# EAGLE design vv_mod_v1 (EAGLE 6.4)
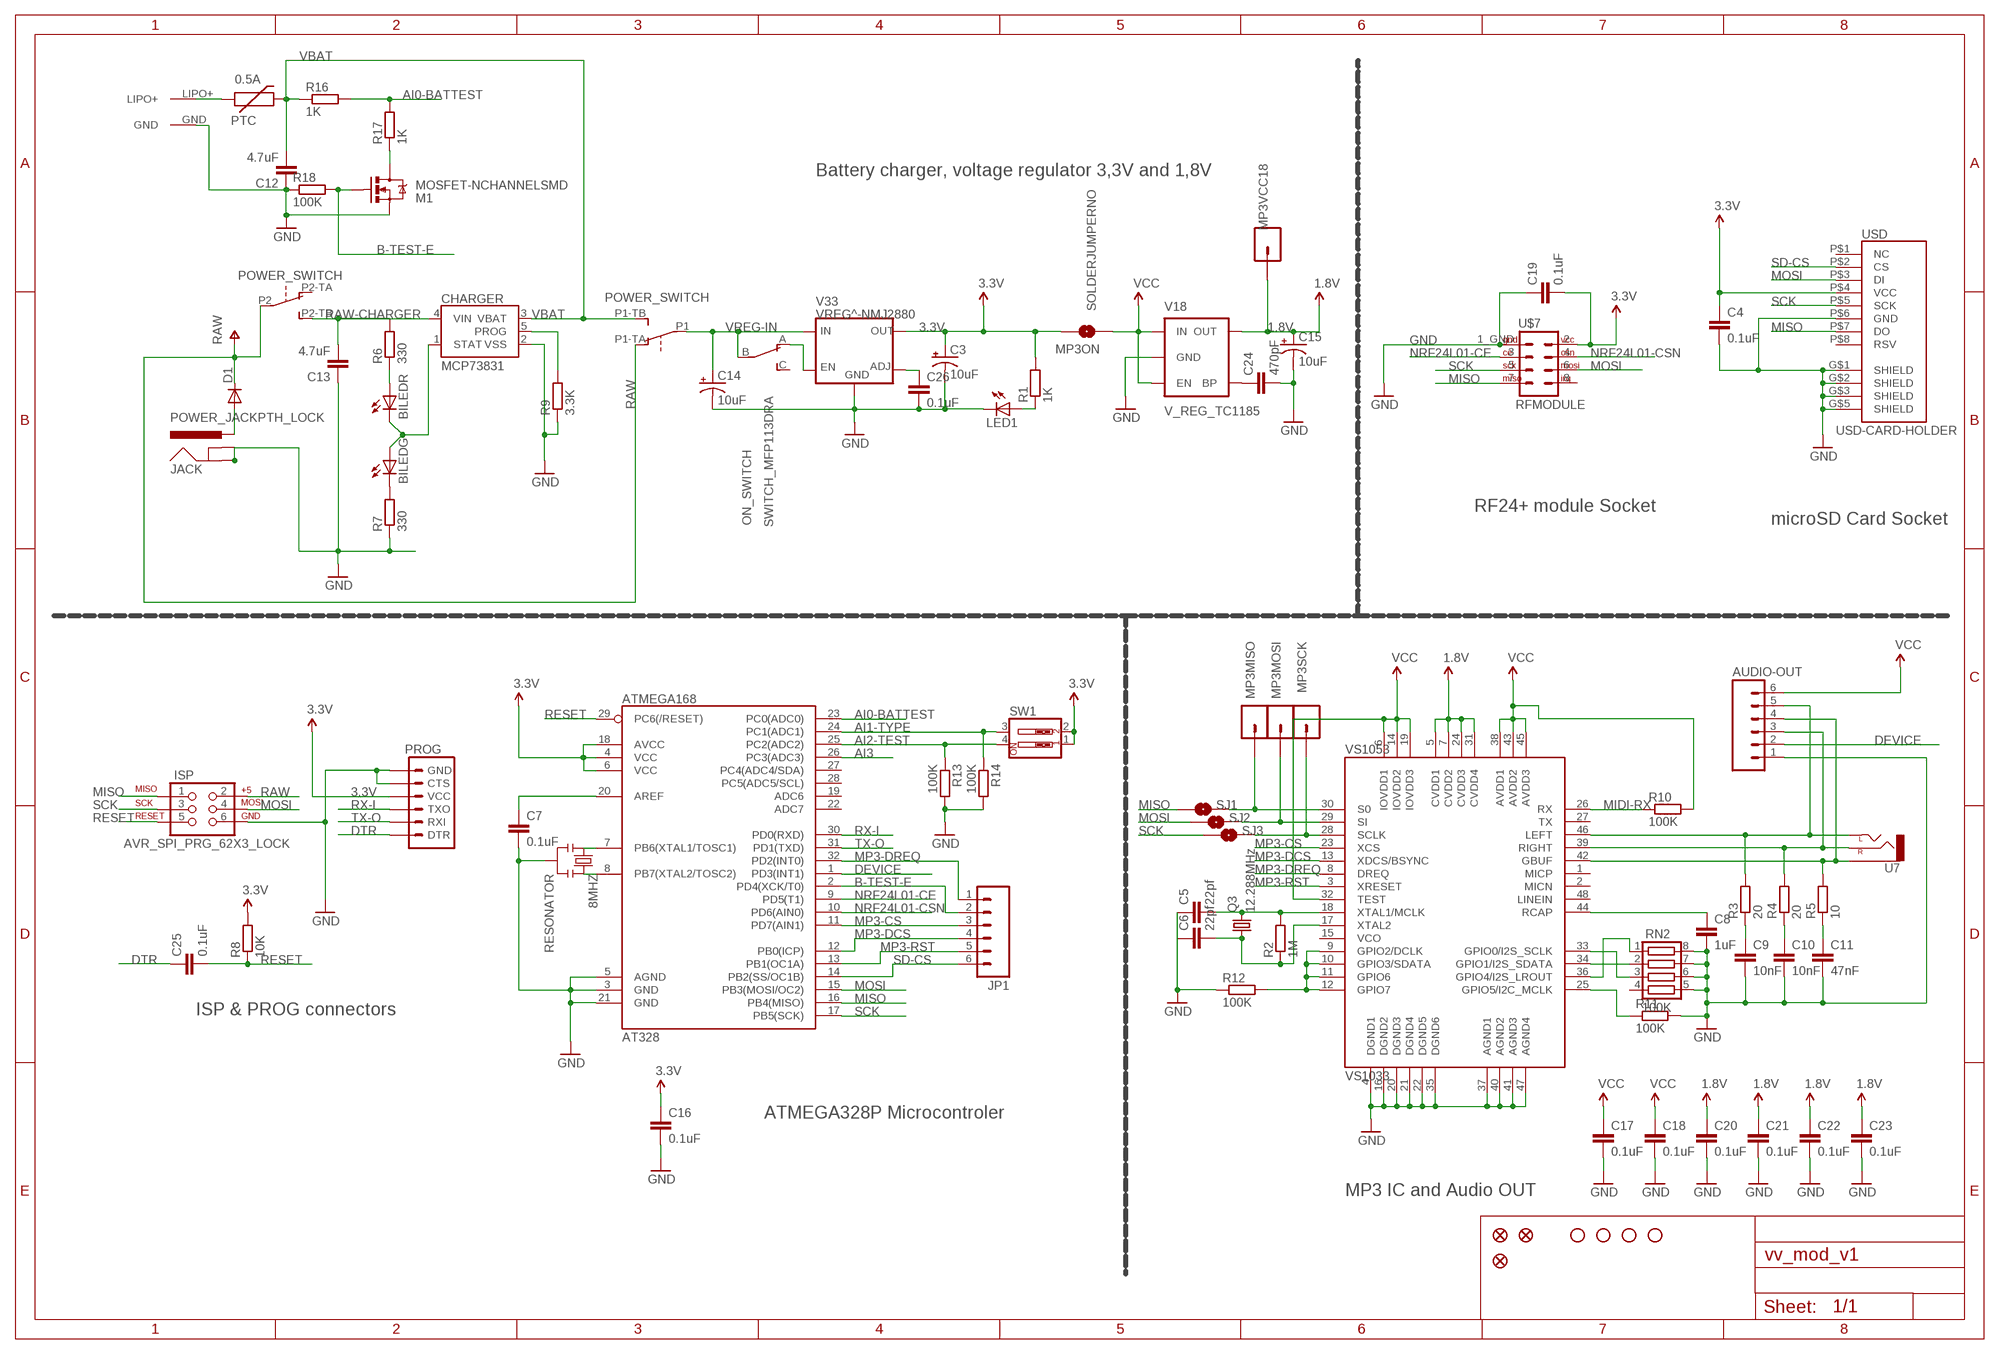
[diagram p0: schematic, sheet 1]

## Parts
0.5A  PTC  [PTC-1210]
8MHZ  RESONATOR  [RESONATOR_7MM]
AT328  ATMEGA168  [TQFP32-08]
AUDIO-OUT  M06LOCK  [1X06_LOCK]
BILED  BILED  [2XLED]
C3  10uF  CAP_POL1206  [EIA3216]
C4  0.1uF  C-EUC0805  [C0805]
C5  22pf  C-EUC0603  [C0603]
C6  22pf  C-EUC0603  [C0603]
C7  0.1uF  C-EUC0805  [C0805]
C8  1uF  C-EUC0603  [C0603]
C9  10nF  C-EUC0603  [C0603]
C10  10nF  C-EUC0603  [C0603]
C11  47nF  C-EUC0603  [C0603]
C12  4.7uF  C-EUC0603  [C0603]
C13  4.7uF  C-EUC0603  [C0603]
C14  10uF  CAP_POL1206  [EIA3216]
C15  10uF  CAP_POL1206  [EIA3216]
C16  0.1uF  C-EUC0805  [C0805]
C17  0.1uF  C-EUC0805  [C0805]
C18  0.1uF  C-EUC0805  [C0805]
C19  0.1uF  C-EUC0805  [C0805]
C20  0.1uF  C-EUC0805  [C0805]
C21  0.1uF  C-EUC0805  [C0805]
C22  0.1uF  C-EUC0805  [C0805]
C23  0.1uF  C-EUC0805  [C0805]
C24  470pF  C-EUC0603  [C0603]
C25  0.1uF  C-EUC0805  [C0805]
C26  0.1uF  C-EUC0805  [C0805]
CHARGER  MCP73831  [SOT23-5]
D1  DIODESMA-KIT  [SMA-DIODE-KIT]
ISP  AVR_SPI_PRG_62X3_LOCK  [2X3_LOCK]
JACK  POWER_JACKPTH_LOCK  [POWER_JACK_PTH_LOCK]
JP1  M06SIP  [1X06]
JP2  FIDUCIAL1X2.5  [FIDUCIAL-1X2.5]
JP3  FIDUCIAL1X2.5  [FIDUCIAL-1X2.5]
JP4  STAND-OFF  [STAND-OFF]
JP5  STAND-OFF  [STAND-OFF]
JP6  STAND-OFF  [STAND-OFF]
JP7  STAND-OFF  [STAND-OFF]
JP8  FIDUCIAL1X2.5  [FIDUCIAL-1X2.5]
LED1  LED1206  [LED-1206]
M1  MOSFET-NCHANNELSMD  [SOT23-3]
MP3MISO  M01SMD-4.5X1.5  [PAD-1.5X4.5]
MP3MOSI  M01SMD-4.5X1.5  [PAD-1.5X4.5]
MP3ON  SOLDERJUMPERNO  [SJ_2S-NO]
MP3SCK  M01SMD-4.5X1.5  [PAD-1.5X4.5]
MP3VCC18  M01SMD-4.5X1.5  [PAD-1.5X4.5]
ON_SWITCH  SWITCH_MFP113DRA  [SWITCH]
POWER_SWITCH  JS202011SCQNPIN  [SWITCHPOWER]
PROG  ARDUINO_SERIAL_PROGRAMLOCK  [1X06_LOCK]
Q3  12.288MHz  CRYSTALHC49UP  [HC49UP]
R1  1K  R-EU_R0603  [R0603]
R2  1M  R-EU_R0603  [R0603]
R3  20  R-EU_R0603  [R0603]
R4  20  R-EU_R0603  [R0603]
R5  10  R-EU_R0603  [R0603]
R6  330  R-EU_R0805  [R0805]
R7  330  R-EU_R0805  [R0805]
R8  10K  R-EU_R0603  [R0603]
R9  3.3K  R-EU_R0603  [R0603]
R10  100K  R-EU_R0805  [R0805]
R11  100K  R-EU_R0805  [R0805]
R12  100K  R-EU_R0805  [R0805]
R13  100K  R-EU_R0805  [R0805]
R14  100K  R-EU_R0805  [R0805]
R16  1K  R-EU_R0603  [R0603]
R17  1K  R-EU_R0603  [R0603]
R18  100K  R-EU_R0805  [R0805]
RN2  100K  CTS742C083  [CTS742C083]
SJ1  SOLDERJUMPERNO  [SJ_2S-NO]
SJ2  SOLDERJUMPERNO  [SJ_2S-NO]
SJ3  SOLDERJUMPERNO  [SJ_2S-NO]
SW1  SW_DIP-2  [DIPSWITCH-02]
U7  AUDIO-JACKPTH  [AUDIO-JACK]
U$7  RFMODULE  [2X5_RFMODULE]
U$8  LIPO_PAD  [2X1_LIPO_PAD]
USD  USD-CARD-HOLDER  [MICRO-SD-MOLEX-47579-001]
V18  V_REG_TC1185  V_REG_LDOSMD  [SOT23-5]
V33  VREG^-NMJ2880  [SOT-89]
VS1053  VS1033  [LQFP-48]

## Nets
1.8V: C15.A(+) C20.1 C21.1 C22.1 C23.1 MP3VCC18.P$1 V18.5(OUT) VS1053.5(CVDD1) VS1053.7(CVDD2) VS1053.24(CVDD3) VS1053.31(CVDD4)
3.3V [3.3V]: AT328.4(VCC) AT328.6(VCC) AT328.18(AVCC) C3.A(+) C4.1 C16.1 C19.2 MP3ON.2 PROG.4(VCC) R1.2 R8.2 SW1.1 SW1.2 U$7.2(VCC) USD.P$4(VCC) V33.4(OUT)
100K-1: R12.2 VS1053.9(GPIO2/DCLK) VS1053.10(GPIO3/SDATA) VS1053.11(GPIO6) VS1053.12(GPIO7)
AI0-BATTEST: AT328.23(PC0(ADC0)) R16.2 R17.2
AI1-TYPE: AT328.24(PC1(ADC1)) R14.1 SW1.3
AI2-TEST: AT328.25(PC2(ADC2)) R13.1 SW1.4
AI3: AT328.26(PC3(ADC3))
AREF: AT328.20(AREF) C7.1
B-TEST-E: AT328.2(PD4(XCK/T0)) JP1.2 M1.1(G) R18.2
DEVICE: AT328.1(PD3(INT1)) AUDIO-OUT.2
DTR: C25.1 PROG.1(DTR)
GBUF: AUDIO-OUT.4 R5.2 U7.SLEEVE VS1053.42(GBUF)
GND [GND]: 8MHZ.2 AT328.3(GND) AT328.5(AGND) AT328.21(GND) AUDIO-OUT.1 C3.C(-) C4.2 C5.1 C6.1 C7.2 C8.2 C9.2 C10.2 C11.2 C12.1 C13.1 C14.C(-) C15.C(-) C16.2 C17.2 C18.2 C19.1 C20.2 C21.2 C22.2 C23.2 C24.2 C26.2 CHARGER.2(VSS) ISP.6 JACK.GND JACK.GNDBREAK LED1.C M1.2(S) PROG.5(CTS) PROG.6(GND) R7.1 R9.1 R11.2 R12.1 R13.2 R14.2 R18.1 RN2.5 RN2.6 RN2.7 RN2.8 U$7.1_GND(GND) U$8.GND USD.G$1(SHIELD) USD.G$2(SHIELD) USD.G$3(SHIELD) USD.G$5(SHIELD) USD.P$6(GND) V18.2(GND) V33.2(GND) VS1053.4(DGND1) VS1053.16(DGND2) VS1053.20(DGND3) VS1053.21(DGND4) VS1053.22(DGND5) VS1053.35(DGND6) VS1053.37(AGND1) VS1053.40(AGND2) VS1053.41(AGND3) VS1053.47(AGND4)
LEFT: AUDIO-OUT.5 R3.2 U7.TIP(LEFT) VS1053.46(LEFT)
MIDI-RX: R10.1 VS1053.26(RX)
MISO: AT328.16(PB4(MISO)) ISP.1 SJ1.1 U$7.7(MISO) USD.P$7(DO)
MISOMP3: MP3MISO.P$1 SJ1.2 VS1053.30(S0)
MOSI: AT328.15(PB3(MOSI/OC2)) ISP.4 SJ2.1 U$7.6(MOSI) USD.P$3(DI)
MOSIMP3: MP3MOSI.P$1 SJ2.2 VS1053.29(SI)
MP3-CS: AT328.11(PD7(AIN1)) JP1.3 VS1053.23(XCS)
MP3-DCS: AT328.12(PB0(ICP)) JP1.4 VS1053.13(XDCS/BSYNC)
MP3-DREQ: AT328.32(PD2(INT0)) JP1.1 VS1053.8(DREQ)
MP3-RST: AT328.13(PB1(OC1A)) JP1.5 VS1053.3(XRESET)
N$1: ON_SWITCH.A(O) V33.1(EN)
N$2: C26.1 V33.3(ADJ)
N$3: RN2.1 VS1053.36(GPIO4/I2S_LROUT)
N$4: LED1.A R1.1
N$5: RN2.3 VS1053.33(GPIO0/I2S_SCLK)
N$6: R11.1 VS1053.25(GPIO5/I2C_MCLK)
N$7: 8MHZ.1 AT328.7(PB6(XTAL1/TOSC1))
N$8: 8MHZ.3 AT328.8(PB7(XTAL2/TOSC2))
N$9: RN2.2 VS1053.34(GPIO1/I2S_SDATA)
N$10: D1.A JACK.PWR
N$16: C9.1 R3.1
N$17: C10.1 R4.1
N$18: C11.1 R5.1
N$20: BILED.A2(R:A) R6.1
N$22: BILED.C3(G:C) R7.2
N$24: CHARGER.5(PROG) R9.2
N$25: M1.3(D) R17.1
N$28: C24.1 V18.4(BP)
NRF24L01-CE: AT328.9(PD5(T1)) U$7.3(CE)
NRF24L01-CSN: AT328.10(PD6(AIN0)) U$7.4(CSN)
RAW: D1.C ISP.2 POWER_SWITCH.P1-TA(O) POWER_SWITCH.P2(P)
RAW-CHARGER: C13.2 CHARGER.4(VIN) POWER_SWITCH.P2-TB(S) R6.2
RCAP: C8.1 VS1053.44(RCAP)
RESET: AT328.29(PC6(/RESET)) C25.2 ISP.5 R8.1
RIGHT: AUDIO-OUT.3 R4.2 U7.RING(RIGHT) VS1053.39(RIGHT)
RX-I: AT328.30(PD0(RXD)) PROG.3(TXO)
SCK: AT328.17(PB5(SCK)) ISP.3 SJ3.1 U$7.5(SCK) USD.P$5(SCK)
SCKMP3: MP3SCK.P$1 SJ3.2 VS1053.28(SCLK)
SD-CS: AT328.14(PB2(SS/OC1B)) JP1.6 USD.P$2(CS)
STAT: BILED.A1(G:A) BILED.C4(R:C) CHARGER.1(STAT)
TX-O: AT328.31(PD1(TXD)) PROG.2(RXI)
VBAT: 0.5A.2 C12.2 CHARGER.3(VBAT) POWER_SWITCH.P1-TB(S) R16.1
VBAT-RAW: 0.5A.1 U$8.LIPO+
VCC [3.3V]: AUDIO-OUT.6 C17.1 C18.1 MP3ON.1 R10.2 V18.1(IN) V18.3(EN) VS1053.6(IOVDD1) VS1053.14(IOVDD2) VS1053.19(IOVDD3) VS1053.32(TEST) VS1053.38(AVDD1) VS1053.43(AVDD2) VS1053.45(AVDD3)
VREG-IN: C14.A(+) ON_SWITCH.B(P) POWER_SWITCH.P1(P) V33.5(IN)
XTAL1_MP3: C5.2 Q3.2 R2.2 VS1053.18(XTAL1/MCLK)
XTAL2_MP3: C6.2 Q3.1 R2.1 VS1053.17(XTAL2)
Unconnected: AT328.19(ADC6) AT328.22(ADC7) AT328.27(PC4(ADC4/SDA)) AT328.28(PC5(ADC5/SCL)) ON_SWITCH.C(S) POWER_SWITCH.P2-TA(O) RN2.4 U$7.8(IRQ) USD.P$1(NC) USD.P$8(RSV) VS1053.1(MICP) VS1053.2(MICN) VS1053.15(VCO) VS1053.27(TX) VS1053.48(LINEIN)

## Notes on the sheet
- Battery charger, voltage regulator 3,3V and 1,8V
- RF24+ module Socket
- microSD Card Socket
- ISP & PROG connectors
- ATMEGA328P Microcontroler
- MP3 IC and Audio OUT

## Library data of the parts
0.5A = pierre_vv:PTC
8MHZ = pierre_vv:RESONATOR
AT328 = SparkFun:ATMEGA168
AUDIO-OUT JP1 = SparkFun:M06: Header 6 Standard 6-pin 0.1" header. Use with straight break away headers (SKU : PRT-00116), right angle break away headers (PRT-00553), swiss pins (PRT-00743), machine pins (PRT-00117), and female headers (PRT-00115). Molex polarized connector foot print use with SKU : PRT-08094 with associated crimp pins and housings. NOTES ON THE VARIANTS LOCK and LOCK_LONGPADS... This footprint was designed to help hold the alignment of a through-hole component (i.e. 6-pin header) while soldering it into place. You may notice that each hole has been shifted either up or down by 0.005 of an inch from it's more standard position (which is a perfectly straight line). This slight alteration caused the pins (the squares in the middle) to touch the edges of the holes. Because they are alternating, it causes a "brace" to hold the component in place. 0.005 has proven to be the perfect amount of "off-center" position when using our standard breakaway headers. Although looks a little odd when you look at the bare footprint, once you have a header in there, the alteration is very hard to notice. Also, if you push a header all the way into place, it is covered up entirely on the bottom side. This idea of altering the position of holes to aid alignment will be further integrated into the Sparkfun Library for other footprints. It can help hold any component with 3 or more connection pins.
BILED = pierre_vv:BILED
C3 C14 C15 = SparkFun:CAP_POL: Capacitor Polarized These are standard SMD and PTH capacitors. Normally 10uF, 47uF, and 100uF in electrolytic and tantalum varieties. Always verify the external diameter of the through hole cap, it varies with capacity, voltage, and manufacturer. The EIA devices should be standard.
C4-C13 C16-C26 = rcl:C-EU: CAPACITOR, European symbol
CHARGER = SparkFun:MCP73831: Microchip's MCP73831 Miniature single cell, fully integrated Li-Ion, Li-polymer charge management controller http://ww1.microchip.com/downloads/en/DeviceDoc/21984a.pdf
D1 = SparkFun:DIODE: Diode These are standard reverse protection diodes and small signal diodes. SMA package can handle up to about 1A. SOD-323 can handle about 200mA. What the SOD-323 package when ordering, there are some mfgs out there that are 5-pin packages.
ISP = SparkFun:AVR_SPI_PRG_6: AVR ISP 6 Pin This is the reduced ISP connector for AVR programming. Common on Arduino. This footprint will take up less PCB space and can be used with a 10-pin to 6-pin adapter such as SKU: BOB-08508
JACK = SparkFun:POWER_JACK: Power Jack This is the standard 5.5mm barrel jack for power. The PTH is the most common, proven, reliable, footprint. All others are experimental. The Slot footprint only works if the mill layer is transmitted to the PCB fab house so be warned. Spark Fun Electronics SKU : PRT-00119. Mating wall wart : TOL-00298 (and others)
JP2 JP3 JP8 = SparkFun:FIDUCIAL: Fiducial Alignment Points Various fiducial points for machine vision alignment.
JP4-JP7 = SparkFun:STAND-OFF: Stand Off This is the mechanical footprint for a #4 phillips button head screw. Use the keepout ring to avoid running the screw head into surrounding components. SKU : PRT-00447
LED1 = SparkFun:LED: LEDs Standard schematic elements and footprints for 5mm, 3mm, 1206, and 0603 sized LEDs. 5mm - Spark Fun Electronics SKU : COM-00529 (and others)
M1 = SparkFun:MOSFET-NCHANNEL
MP3MISO MP3MOSI MP3SCK MP3VCC18 = SparkFun:M01: Header 1 Standard 1-pin 0.1" header. Use with straight break away headers (SKU : PRT-00116), right angle break away headers (PRT-00553), swiss pins (PRT-00743), machine pins (PRT-00117), and female headers (PRT-00115).
MP3ON SJ1-SJ3 = SparkFun:SOLDERJUMPER: Solder Jumper Standard SMD solder jumper. Used to automate production. Two varients : Normally Open and Normally Closed are the same, but have different paste layers. NC will have a large amount of paste and should jumper during reflow.
ON_SWITCH = pierre_vv:SWITCH_MFP113DRA
POWER_SWITCH = pierre_vv:JS202011SCQN
PROG = SparkFun:ARDUINO_SERIAL_PROGRAM
Q3 = crystal:CRYSTAL: CRYSTAL; OC_FARNELL: unknown; OC_NEWARK: unknown
R1-R14 R16-R18 = rcl:R-EU_: RESISTOR, European symbol
RN2 = resistor-net:CTS742C083: Chip Resistor Array 4 Single Resistor Source: http://www.ctscorp.com/components/Datasheets/CTSChipArrayDs.pdf; OC_FARNELL: unknown; OC_NEWARK: unknown
SW1 = SparkFun:SW_DIP-2: DIP SWITCH
U7 = SparkFun:AUDIO-JACK: 3.5mm Audio Jack Simple 3.5mm common PCB mount audio jack. SKU: PRT-08032
U$7 = pierre_vv:RFMODULE
U$8 = pierre_vv:LIPO_PAD
USD = pierre_vv:USD-CARD-HOLDER
V18 = SparkFun:V_REG_LDO: Voltage Regulator LDO Standard 150mA LDO voltage regulator in SOT-23 layout. Micrel part MIC5205. BP (by-pass) pin is used to lower output noise with 470pF cap.
V33 = pierre_vv:VREG^-NMJ2880
VS1053 = SparkFun:VS1033

## Net classes
0 default: width 0.203 mm
1 GND: width 0.254 mm
2 3.3V: width 0.254 mm

## Board
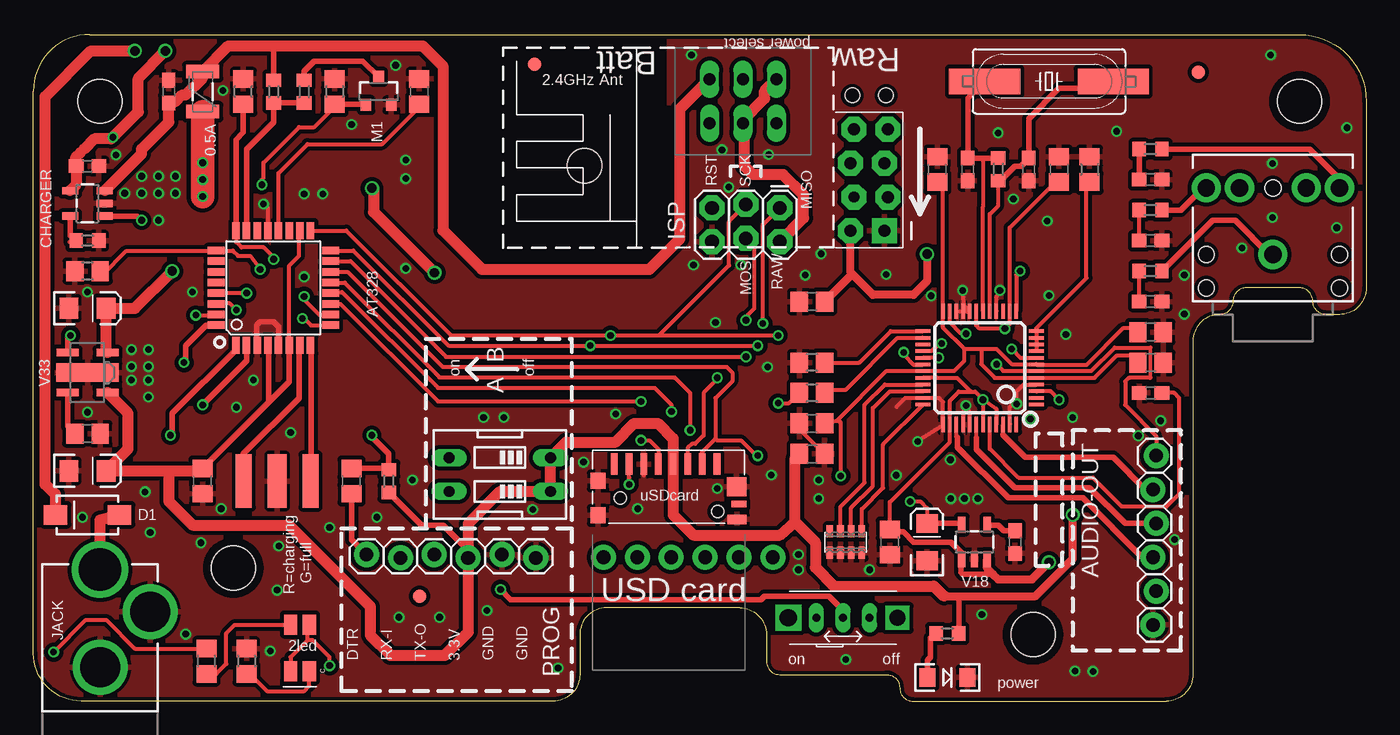
[diagram p1: board, top side]
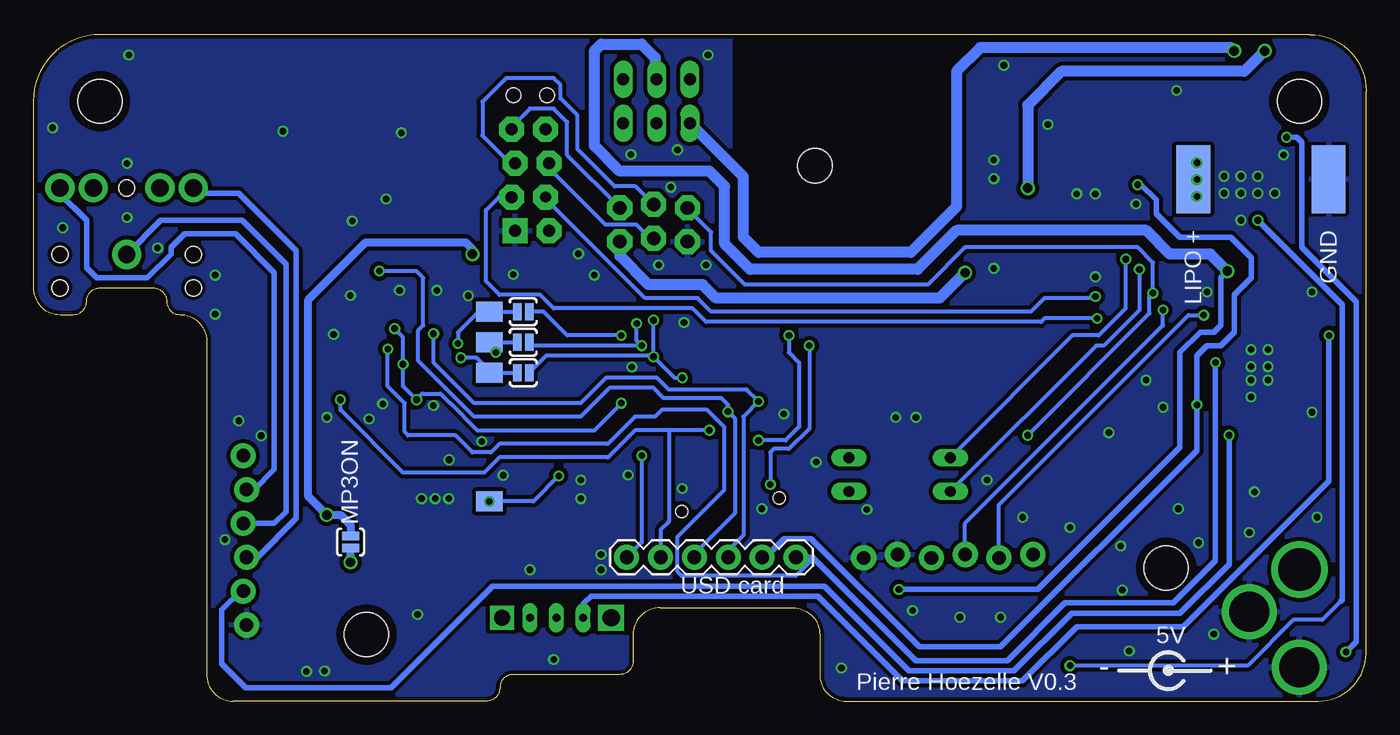
[diagram p2: board, bottom side, seen from below]

Size 100 x 50 mm. Coordinates in mm from the lower left corner, seen from the top.
Outline: 4.24,50 arc90 0,45.76 0,3.61 arc90 3.61,0 39,0 arc90 41,2 41,5 arc-90 43,7 53,7 arc-90 55,5 55,3 arc90 56,2 64,2 arc-90 65,1 arc90 66,0 85,0 arc90 87,2 87,27 arc-90 89,29 arc90 90,30 arc-90 91,31 95,31 arc-90 96,30 arc90 97,29 98,29 arc90 100,31 100,45 arc90 95,50 4.24,50
Copper layers (1*16): Top 0.035mm / dielectric 1.5mm / Bottom 0.035mm
Design rules "Fusion_eagle_rule_v1.1": minimum track width 6mil, minimum drill 12mil, track to track 6mil, track to pad 6mil, pad to pad 6mil, via to via 6mil, smd to smd 0mil, copper to edge 10mil, drill to drill 10mil, minimum pad ring 10mil, minimum via ring 6mil, stop-mask expansion 2mil, vias tented up to drill 100mil, thermal gap 10mil
Holes 2.6 mm at 41.37,40.17

### Footprints (pad centres in the part's own frame; a part is rotated, then mirrored left to right if it is on the bottom)
PTC-1210 = smd 1 x 2.5: 1 -1.5,0; 2 1.5,0
RESONATOR_7MM = smd 1.2 x 4: 1 -2.5,0; 3 2.5,0 | smd 1.4 x 4: 2 0,0
TQFP32-08 = smd 1.27 x 0.559: 1 -4.293,2.8; 2 -4.293,2; 3 -4.293,1.2; 4 -4.293,0.4; 5 -4.293,-0.4; 6 -4.293,-1.2; 7 -4.293,-2; 8 -4.293,-2.8; 17 4.293,-2.8; 18 4.293,-2; 19 4.293,-1.2; 20 4.293,-0.4; 21 4.293,0.4; 22 4.293,1.2; 23 4.293,2; 24 4.293,2.8 | smd 0.559 x 1.27: 9 -2.8,-4.293; 10 -2,-4.293; 11 -1.2,-4.293; 12 -0.4,-4.293; 13 0.4,-4.293; 14 1.2,-4.293; 15 2,-4.293; 16 2.8,-4.293; 25 2.8,4.293; 26 2,4.293; 27 1.2,4.293; 28 0.4,4.293; 29 -0.4,4.293; 30 -1.2,4.293; 31 -2,4.293; 32 -2.8,4.293
1X06_LOCK = drill 1.016 pad 1.88: 1 0,0; 2 2.54,-0.254; 3 5.08,0; 4 7.62,-0.254; 5 10.16,0; 6 12.7,-0.254
2XLED = smd 1.5 x 1: A1 1.75,-0.7; A2 1.75,0.7; C3 -1.75,-0.7; C4 -1.75,0.7
EIA3216 = smd 1.4 x 1.6: A 1.4,0; C -1.4,0
C0805 = smd 1.3 x 1.5: 1 -0.95,0; 2 0.95,0
C0603 = smd 1.1 x 1: 1 -0.85,0; 2 0.85,0
SOT23-5 = smd 0.55 x 1.2: 1 -0.95,-1.3; 2 0,-1.3; 3 0.95,-1.3; 4 0.95,1.3; 5 -0.95,1.3
SMA-DIODE-KIT = smd 1.77 x 1.47: A -2.4,0; C 2.4,0
2X3_LOCK = drill 1.016 pad 1.88 octagon: 1 0,0; 2 0,2.54; 3 2.54,-0.254; 4 2.54,2.286; 5 5.08,0; 6 5.08,2.54
POWER_JACK_PTH_LOCK = drill 2.997 pad 4.115: GND 0.025,6.557; GNDBREAK 3.762,10.7 | drill 3.2 pad 4.115: PWR 0,13.878
1X06 = drill 1.016 pad 1.88: 1 0,0; 2 2.54,0; 3 5.08,0; 4 7.62,0; 5 10.16,0; 6 12.7,0
FIDUCIAL-1X2.5 = smd 1 x 1: 1 0,0
STAND-OFF = hole 3.302: 0,0
LED-1206 = smd 1.2 x 1.4: A -1.5,0; C 1.5,0
SOT23-3 = smd 0.8 x 0.9: 1 -0.95,-1; 2 0.95,-1; 3 0,1.1
PAD-1.5X4.5 = smd 1.5 x 2: P$1 0,0
SJ_2S-NO = smd 0.635 x 1.27: 1 -0.45,0; 2 0.45,0
SWITCH = drill 0.6 long: A -2,0; B 0,0; C 2,0 | drill 1.3 square: N -4.1,0 | drill 1.2 square: N2 4.1,0
SWITCHPOWER = drill 0.9 long: P1 -1.65,0; P1-TA -1.65,2.5; P1-TB -1.65,-2.5; P2 1.65,0; P2-TA 1.65,2.5; P2-TB 1.65,-2.5
HC49UP = smd 5.334 x 1.93: 1 -4.826,0; 2 4.826,0
R0603 = smd 1 x 1.1: 1 -0.85,0; 2 0.85,0
R0805 = smd 1.3 x 1.5: 1 -0.95,0; 2 0.95,0
CTS742C083 = smd 0.5 x 0.9: 1 -1.2,-0.8; 2 -0.4,-0.8; 3 0.4,-0.8; 4 1.2,-0.8; 5 1.2,0.8; 6 0.4,0.8; 7 -0.4,0.8; 8 -1.2,0.8
DIPSWITCH-02 = drill 0.813 long: 1 -1.27,-3.81; 2 1.27,-3.81; 3 1.27,3.81; 4 -1.27,3.81
AUDIO-JACK = drill 1.3 pad 2.184: RING 5,5; RSH 5,2.5; SLEEVE 0,0; TIP 5,-5; TSH 5,-2.5 | hole 1.2: 0,5; -2.5,5; -2.5,-5; 0,-5; 5,0
2X5_RFMODULE = drill 0.9 pad 1.88 square: 1_GND 1.397,-1.27 | drill 0.9 pad 1.88 octagon: 2 3.937,-1.27; 3 1.143,-3.81; 5 1.397,-6.35; 6 3.937,-6.35; 7 1.143,-8.89; 8 3.683,-8.89 | drill 0.8 pad 1.88 octagon: 4 3.683,-3.81 | hole 1.1: 1.27,-11.43; 3.81,-11.43
2X1_LIPO_PAD = smd 5.08 x 2.54 bottom: GND -3.81,1.27; LIPO+ -3.81,-8.89
MICRO-SD-MOLEX-47579-001 = smd 1.15 x 1.2: G$1 -0.425,2.3; G$2 -0.425,4.9 | smd 1.45 x 1.4: G$3 -10.825,2.75 | smd 1.1 x 0.5: G$4 -11,4.05 | smd 1.4 x 0.7: G$5 -10.85,5.2 | smd 0.5 x 1.6: P$1 -9.35,1.05; P$2 -8.25,1.05; P$3 -7.15,1.05; P$4 -6.05,1.05; P$5 -4.95,1.05; P$6 -3.85,1.05; P$7 -2.75,1.05; P$8 -1.65,1.05 | hole 0.9: -9.4,4.6; -2.1,3.6
SOT-89 = smd 0.57 x 1.65: 1 -1.5,-1.5; 3 1.5,-1.5; 4 1.5,1.5; 5 -1.5,1.5 | smd 1.397 x 4.699: 2 0,0
LQFP-48 = smd 0.254 x 1.143: 1 -2.75,-4.25; 2 -2.25,-4.25; 3 -1.75,-4.25; 4 -1.25,-4.25; 5 -0.75,-4.25; 6 -0.25,-4.25; 7 0.25,-4.25; 8 0.75,-4.25; 9 1.25,-4.25; 10 1.75,-4.25; 11 2.25,-4.25; 12 2.75,-4.25; 25 2.75,4.25; 26 2.25,4.25; 27 1.75,4.25; 28 1.25,4.25; 29 0.75,4.25; 30 0.25,4.25; 31 -0.25,4.25; 32 -0.75,4.25; 33 -1.25,4.25; 34 -1.75,4.25; 35 -2.25,4.25; 36 -2.75,4.25 | smd 1.143 x 0.254: 13 4.25,-2.75; 14 4.25,-2.25; 15 4.25,-1.75; 16 4.25,-1.25; 17 4.25,-0.75; 18 4.25,-0.25; 19 4.25,0.25; 20 4.25,0.75; 21 4.25,1.25; 22 4.25,1.75; 23 4.25,2.25; 24 4.25,2.75; 37 -4.25,2.75; 38 -4.25,2.25; 39 -4.25,1.75; 40 -4.25,1.25; 41 -4.25,0.75; 42 -4.25,0.25; 43 -4.25,-0.25; 44 -4.25,-0.75; 45 -4.25,-1.25; 46 -4.25,-1.75; 47 -4.25,-2.25; 48 -4.25,-2.75

### Placement (x,y rotation side)
0.5A  12.7,45.72 90 top
8MHZ  18.29,16.51 0 top
AT328  18,31 90 top
AUDIO-OUT  84,5.71 90 top
BILED  20,4 90 top
C3  4.06,17.27 0 top
C4  58.42,18.54 0 top
C5  70.1,39.88 90 top
C6  74.68,39.88 90 top
C7  28.96,45.72 90 top
C8  83.82,23.11 180 top
C9  83.82,39.12 0 top
C10  83.82,34.54 0 top
C11  83.82,29.97 0 top
C12  10.16,45.72 270 top
C13  4.06,40.13 180 top
C14  4.06,29.46 0 top
C15  67.06,11.94 90 top
C16  12.7,16.51 270 top
C17  76.96,39.88 90 top
C18  64.26,11.94 270 top
C19  58.42,29.97 0 top
C20  83.82,25.4 0 top
C21  67.82,39.88 90 top
C22  58.42,20.83 180 top
C23  83.82,27.69 0 top
C24  73.66,11.94 270 top
C25  23.88,16.51 90 top
C26  4.06,20.07 0 top
CHARGER  4.06,37.34 90 top
D1  4.06,13.97 180 top
ISP  56,37 180 top
JACK  5,-4 0 top
JP1  42.78,10.8 180 bottom
JP2  87.41,47.16 0 top
JP3  28.99,7.89 0 top
JP4  15,10 0 top
JP5  75,5 90 top
JP6  95,45 0 top
JP7  5,45 0 top
JP8  37.59,47.75 0 top
LED1  68.58,1.78 0 top
M1  25.91,45.72 0 top
MP3MISO  65.79,26.92 90 bottom
MP3MOSI  65.79,24.64 270 bottom
MP3ON  76.2,11.94 90 bottom
MP3SCK  65.79,29.21 270 bottom
MP3VCC18  65.79,14.99 270 bottom
ON_SWITCH  60.75,6.25 0 top
POWER_SWITCH  53.24,45 270 top
PROG  25,11 0 top
Q3  76.2,46.48 180 top
R1  68.58,5.08 0 top
R2  72.39,39.88 90 top
R3  83.82,41.4 0 top
R4  83.82,36.83 0 top
R5  83.82,32.26 0 top
R6  13,3 90 top
R7  16,3 270 top
R8  26.67,16.51 270 top
R9  4.06,34.54 180 top
R10  58.42,23.11 180 top
R11  58.42,25.4 180 top
R12  79.25,39.88 270 top
R13  4.06,32.26 180 top
R14  15.75,45.72 90 top
R16  18.03,45.72 270 top
R17  20.32,45.72 270 top
R18  22.61,45.72 270 top
RN2  60.96,11.94 180 top
SJ1  63.25,26.92 180 bottom
SJ2  63.25,24.64 180 bottom
SJ3  63.25,29.21 180 bottom
SW1  35,17 90 top
U7  93,33.5 90 top
U$7  65.25,34 180 top
U$8  4.09,42.96 90 top
USD  41.95,18.83 180 top
V18  70.61,11.94 0 top
V33  4.06,24.64 270 top
VS1053  71,25 90 top

### Tracks (layer width: path | path; a pad name or v marks a point on that pad's centre or on a via)
1.8V  (via drill 0.5, 0.5 pad 0.81)
  Top 0.305: C23.1 83.14,27.99 81.79,27.99 79.05,25.25 VS1053.7 75.23,25.27 73.41,25.27 72.26,26.42 71.12,26.42 | C20.1 83.08,25.93 81.31,25.93 79.62,24.25 VS1053.5 72.14,24.26 71.12,25.27 71.12,26.42 | VS1053.24 | 69.85,26.42 69.85,25.53 69.09,24.77 66.77,24.77 VS1053.31 66.73,24.77 64.01,24.77 60.24,21 | 69.85,26.42 68.25,28.02 VS1053.24 | 69.85,26.42 71.12,26.42 | 60.24,21 C22.1 | 60.24,21 60.58,20.92 v60.58,16.89 | C15.A 67.06,14.48 66.55,14.99 MP3VCC18.P$1 | C21.1 68.25,38.5 VS1053.24
  Top 0.406: V18.5 69.56,13.34 C15.A
  Bottom 0.305: v60.58,16.89 62.48,14.99 MP3VCC18.P$1
  other vias: 65.79,14.99
3.3V  (via drill 0.7)
  Top 0.305: 32.64,10.77 PROG.4 32.62,10.56 32.64,10.54 | 17.65,26.65 AT328.4 | AT328.6 19.2,32.66 19.94,33.4 19.94,35.23 AT328.18
  Top 0.406: 17.65,22.41 17.65,26.65 | C16.1 17.65,22.41 | AT328.6 19.2,23.96 17.65,22.41 | R8.2 29.12,13.21 30.73,13.21 32.62,11.32 PROG.4 | 68.33,7.87 69.43,7.87 R1.2
  Top 0.61: v77.98,13.97 77.98,10.67 75.18,7.87 68.33,7.87 | v67.06,33.53 67.06,31.5 66.04,30.48 62.99,30.48 61.32,32.16 | 61.32,32.16 U$7.2 | C19.2 61.32,31.92 61.32,32.16
  Top 0.813: 32.64,10.54 32.64,5.21 30.86,3.43 26.8,3.43 25.27,4.95 25.27,7.11 19.18,13.21 11.94,13.21 10.16,14.99 10.16,17.27 | 32.64,10.54 32.64,10.77 32.64,13.34 35.03,15.73 SW1.1 SW1.2 39.97,19.43 43.69,19.43 45.09,20.83 46.86,20.83 47.99,19.7 USD.P$4 48.01,17.77 48.01,13.97 49.53,12.45 56.01,12.45 57.15,13.46 | 32.64,10.54 32.38,10.29 | 57.15,13.46 58.67,11.94 58.67,10.03 60.07,8.64 67.56,8.64 68.33,7.87 | V33.4 7.11,21.59 7.11,18.92 C3.A 10.16,17.27 | 10.16,17.27 12.51,17.27 C16.1 | C4.1 57.15,18.22 57.15,13.46
  Bottom 0.61: MP3ON.2 76.2,13.21 76.96,13.97 v77.98,13.97 79.38,15.37 79.38,30.1 75.06,34.42 67.56,34.42 67.06,33.91 v67.06,33.53
100K-1
  Top 0.305: VS1053.9 VS1053.10 VS1053.11 VS1053.12 75.25,27.95 79.02,31.73 79.02,39.13 R12.2
AI0-BATTEST
  Top 0.305: R17.2 20.46,44.86
  Top 0.406: AT328.23 16,41.4 18.03,43.43 R16.2 R17.2
AI1-TYPE  (via drill 0.5 pad 0.81)
  Top 0.305: AT328.24 15.24,35.25 15.24,34.42 15.62,34.04 17.27,34.04 17.91,33.4 v18.03,33.15
  Top 0.406: AT328.24 15.2,42.12 15.75,42.67 R14.1
  Bottom 0.305: SW1.3 22.03,27.43 20.07,27.43 18.03,29.46 v18.03,33.15
AI2-TEST  (via drill 0.5 pad 0.81)
  Top 0.305: R13.1 5.2,32 6.99,33.78 13.69,33.78 AT328.25 14.97,33.8 15.37,33.4 16.26,33.4 v17.02,32.38
  Bottom 0.305: SW1.4 20.25,26.67 19.68,26.67 17.02,29.34 v17.02,32.38
AREF
  Top 0.305: AT328.20 18.4,39.61 20.57,41.78 26.16,41.78 28.75,44.37 C7.1 28.94,45.09
B-TEST-E  (via drill 0.5 pad 0.81)
  Top 0.305: AT328.2 | R18.2 22.75,44.72 21.08,43.05 19.94,43.05 17.27,40.39 17.27,39.24 17.14,39.12 v17.14,38.73
  Top 0.406: R18.2 24.91,44.77 M1.1 | AT328.2 16,25.52 v12.7,22.23
  Bottom 0.305: 17.02,38.73 v17.14,38.73
  Bottom 0.406: 17.02,38.73 16.89,38.73 15.75,37.59 15.75,36.58 13.97,34.8 10.16,34.8 8.64,33.27 8.64,31.75 9.91,30.48 9.91,27.69 10.92,26.67 11.94,26.67 12.7,25.91 v12.7,22.23 12.7,18.8 27.43,4.06 33.53,4.06 41.66,12.19 43.69,12.19 45.08,10.8 JP1.2
DEVICE  (via drill 0.5 pad 0.81)
  Top 0.406: AT328.1 15.2,26.38 10.41,21.59 10.41,20.07 v10.29,19.94
  Bottom 0.406: v10.29,19.94 10.29,10.29 13.97,6.6 22.1,6.6 26.42,2.29 34.29,2.29 40.64,8.64 65.53,8.64 73.15,1.02 84.07,1.02 85.85,2.79 85.85,6.86 84.46,8.25 AUDIO-OUT.2
DTR
  Top 0.406: PROG.1 23.88,12.12 C25.1
GBUF
  Top 0.305: VS1053.42 70.74,19.76
  Top 0.406: 70.74,19.76 70.74,18.9 73.64,16 79.25,16 81.92,13.33 AUDIO-OUT.4 | R5.2 88.48,36.07 90.17,36.07 92.74,33.5 U7.SLEEVE
  Bottom 0.406: U7.SLEEVE 90.43,36.07 84.33,36.07 81.03,32.77 81.03,14.22 81.92,13.33 AUDIO-OUT.4
GND  (via drill 0.5 pad 0.81)
  Top 0.305: 45.8,16.94 USD.P$6 | USD.G$1 42.52,16.38 | C20.2 84.71,25.86 84.71,25.65 | 64.77,22.05 64.77,22.1 65.41,22.73 66.73,22.73 VS1053.35 66.77,22.73 67.94,22.73 68.25,22.43 VS1053.37 68.15,20.65 v66.34,19.48 | VS1053.47 73.28,20.78 73.28,22.1 73.48,22.3 v73.79,22.3 73.79,23.24 74.3,23.75 VS1053.4 | VS1053.22 VS1053.21 VS1053.20 69.85,29.65 v69.72,30.81 | VS1053.16 72.26,29.26 72.26,30.35 72.52,30.61 v72.52,30.81 | AT328.21 17.6,36.96 v17.27,37.29 | C4.2 57.15,20.7 C22.2 | 18.41,26.72 AT328.5 | VS1053.40 69.75,21.69 v69.98,22.17 70.25,21.65 VS1053.41 | AT328.3 16.89,26.8 | R13.2 3.15,32.23
  Top 0.406: 18.41,26.72 18.41,28.07 18.03,28.45 17.02,28.45 16.76,28.19 16.76,26.74 AT328.3
  other vias: 72.39,42.62 81.28,42.75 92.96,40.34 92.96,36.27 86.36,29.03 86.36,31.95 97.79,35.51 84.58,21.03 74.8,21.16 59.11,33.55 49.53,32.72 51.18,28.4 68.81,18.11 51.31,15.95 30.48,6.3 19.3,20.14 14.22,45.8 27.18,47.7 17.78,3.76 22.23,13.03 18.29,8.33 3.68,13.79 9.4,36.07 7.37,24.08 11.94,30.68 4.06,21.67 9.4,38.1 8.13,38.1 27.94,40.59 20.32,38.05 20.32,31.83 15.24,22.05 37.47,14.38 57.4,9.86 57.4,11 58.93,15.19 77.98,21.29 69.85,15.19 62.74,9.86 79.5,2.24 85.62,12.12 77.47,27.51 76.2,30.43 76.07,36.02 92.84,48.46 98.55,43 27.94,32.46 35.31,21.29 57.91,31.95 4.06,30.68 8.38,15.7 34.04,6.81 11.43,5.03 8.76,12.65 18.41,11.63 27.43,6.3 39.37,2.49 73.53,37.67 52.17,38.56 55.37,16.97 58.93,16.59 33.78,21.29 21.72,38.05 27.94,39.19 23.88,43.26 8.64,24.08 25.78,13.79 28.45,16.59 45.34,14.43 43.69,21.54 78.16,2.26 64.74,16.94 71.17,6.5 60.96,3.12 7.37,25.1 8.64,25.1 8.64,22.81 8.64,26.37 7.37,26.37 6.86,38.1 10.67,38.1 9.4,39.37 10.67,39.37 16.51,24.08 14.1,14.43 6.2,40.97 70.87,15.19 68.83,15.19 82.91,19.91 41.27,17.93 90.68,33.99 12.57,11.89 63.98,32 51.66,41.35 49.38,48.46 55.17,41 53.09,32.72 8.13,39.37 67.36,30.4 55.09,25.07
  pour Top (isolate 0.305): 0,0 41.1,0 41.1,-0.03 100,-0.03 100,50 47.73,50 47.73,36.72 arc-90 45.19,32.91 33.81,32.91 arc-90 31.27,36.72 31.27,50 0,50
  pour Bottom (isolate 0.305): 0,0 100,0 100,50 47.73,50 47.73,36.72 arc-90 45.19,32.91 33.81,32.91 arc-90 31.27,36.72 31.27,50 0,50
LEFT
  Top 0.305: VS1053.46 72.75,19.99
  Top 0.406: 72.75,19.99 74.45,18.29 81.03,18.29 83.44,15.87 AUDIO-OUT.5 | R3.2 95.76,41.4 98,39.16 U7.TIP
  Bottom 0.406: U7.TIP 98.04,38.46 98.04,38.1 96.01,36.07 96.01,32.51 95.25,31.75 91.44,31.75 89.66,33.53 89.66,34.04 88.65,35.05 84.84,35.05 81.92,32.13 81.92,17.4 83.44,15.87 AUDIO-OUT.5
MIDI-RX
  Top 0.305: 66.68,27.25 VS1053.26 64.84,27.25 60.96,23.37 59.62,23.37 R10.1
MISO  (via drill 0.5 pad 0.81)
  Top 0.305: AT328.16 24.01,33.8 31.14,26.67 v41.78,26.67 v54.36,26.67 54.41,26.67 54.36,26.62 | ISP.1 54.74,35.74 v54.74,28.32 | USD.P$7 44.7,16.77 v44.7,16.26
  Bottom 0.305: 56,36.95 ISP.1 59.94,40.94 59.94,43.43 60.96,44.45 62.74,44.45 64.11,43.08 U$7.7 | v54.74,28.32 54.74,27.05 v54.36,26.67 62.54,26.67 SJ1.1 | v44.7,16.26 44.7,18.67 44.45,18.92 43.31,18.92 41.78,20.45 v41.78,26.67
MISOMP3  (via drill 0.5)
  Top 0.305: VS1053.30 66.04,25.25 65.3,25.98 v65.3,26.16
  Bottom 0.305: SJ1.2 MP3MISO.P$1 65.48,26.62 v65.3,26.16
MOSI  (via drill 0.5, 0.5 pad 0.81)
  Top 0.305: AT328.15 23.79,33 30.96,25.83 v53.47,25.83 | USD.P$3 49.09,19 49.4,19.3 49.66,19.3 50.29,19.94 50.29,23.11 51.31,24.13 v51.31,24.26 | ISP.4 54.1,34.07 54.1,29.46 53.47,28.83 v53.47,28.57
  Bottom 0.305: v51.31,24.26 51.89,24.26 v53.47,25.83 v53.46,25.84 53.47,25.85 | 53.47,25.85 v53.47,28.57 | ISP.4 53.74,34.71 54.76,35.74 57.07,35.74 61.32,39.98 U$7.6 | 53.47,25.85 53.53,25.91 61.53,25.91 SJ2.1
MOSIMP3  (via drill 0.5)
  Top 0.305: VS1053.29 v67.92,25.76
  Bottom 0.305: MP3MOSI.P$1 SJ2.2 | MP3MOSI.P$1 66.04,24.38 | v67.92,25.76 v67.91,25.75 VS1053.29 65.79,24.79 MP3MOSI.P$1
MP3-CS  (via drill 0.5 pad 0.81)
  Top 0.305: AT328.11 23.03,29.8 30.35,22.48 v45.59,22.48 | VS1053.23 68.75,28.41 69.6,27.56 v69.98,27.56
  Bottom 0.305: v69.98,27.56 69.98,25.4 66.93,22.35 58.93,22.35 57.02,24.26 53.21,24.26 52.32,23.37 46.48,23.37 v45.59,22.48 46.74,21.34 46.74,12.45 47.86,11.32 JP1.3
MP3-DCS  (via drill 0.5 pad 0.81)
  Top 0.305: AT328.12 22.38,30.68 23.16,30.68 30.35,23.5 46.61,23.5 47.88,22.23 v47.88,21.72 | VS1053.13 73.75,31.97 v74.04,32.26
  Bottom 0.305: v74.04,32.26 71.25,32.26 70.74,31.75 70.74,28.19 71.12,27.81 71.12,25.53 66.93,21.34 58.93,21.34 56.77,23.5 53.47,23.5 52.7,22.73 48.39,22.73 47.88,22.23 v47.88,21.72 47.37,21.21 47.37,14.1 50.4,11.07 JP1.4
MP3-DREQ  (via drill 0.5 pad 0.81)
  Top 0.305: VS1053.8 74.07,25.75 v73.41,26.42
  Top 0.406: AT328.32 12.96,28.2 11.43,26.67 11.43,25.53 v11.3,25.4
  Bottom 0.305: 11.3,25.15 v11.3,25.4 | v73.41,26.42 73.41,23.62 72.14,22.35 72.14,20.19 71.88,19.94 68.33,19.94 67.06,18.67 65.66,18.67 65.02,19.3 56.9,19.3 54.86,21.34 53.34,21.34 52.83,21.84 49.45,21.84 48.16,20.55 48.16,15.85 51.66,12.34 51.66,9.7 51.36,9.4 42.8,9.4 41.66,10.54
  Bottom 0.406: 11.3,25.15 11.3,10.54 14.48,7.37 22.61,7.37 26.92,3.05 33.78,3.05 41.53,10.79 41.66,10.79 41.66,10.8 JP1.1 41.92,10.8 41.66,10.54
MP3-RST  (via drill 0.5 pad 0.81)
  Top 0.305: AT328.13 23.36,31.4 30.48,24.28 48.13,24.28 48.13,24.26 49.28,23.11 v49.28,20.32 | VS1053.3 76.33,23.24 v76.96,22.61
  Bottom 0.305: v76.96,22.61 76.96,21.84 72.26,17.14 66.17,17.14 65.02,18.29 56.9,18.29 54.86,20.32 52.32,20.32 | v49.28,20.32 52.32,20.32 | 52.32,20.32 52.32,13.46 52.94,12.85 JP1.5
N$1  (via drill 0.5)
  Top 0.305: V33.1 2.71,26.21
  Top 0.406: V33.1 2.56,27.2 v2.79,27.43
  Bottom 0.406: v2.79,27.43 2.79,16.51 13.72,5.59 21.72,5.59 25.78,1.52 34.8,1.52 41.15,7.87 58.17,7.87 58.75,7.29 ON_SWITCH.A
N$2
  Top 0.406: V33.3 2.56,20.62 C26.1
N$3
  Top 0.305: VS1053.36 63.75,19.25 63.75,16 62.16,14.41 RN2.1
N$4
  Top 0.406: R1.1 67.31,4.76 67.31,3.3 67.08,3.07 LED1.A
N$5
  Top 0.305: VS1053.33 63.88,23.75 62.36,22.23 62.36,16.38 60.56,14.59 RN2.3
N$6
  Top 0.305: R11.1 61.98,25.4 64.33,27.75 VS1053.25
N$7
  Top 0.305: 19.94,26.65 AT328.7
  Top 0.406: 19.94,26.65 19.94,22.73 15.75,18.54 15.75,16.55 8MHZ.1
N$8
  Top 0.305: 20.83,26.68 AT328.8
  Top 0.406: 20.83,26.68 20.83,16.55 8MHZ.3
N$9
  Top 0.305: VS1053.34 64.26,23.24 62.99,21.97 62.99,16.13 61.36,14.5 RN2.2
N$10
  Top 0.813: JACK.PWR 5,13.6 D1.A
N$16
  Top 0.406: C9.1 R3.1
N$17
  Top 0.305: C10.1 R4.1
N$18
  Top 0.305: C11.1 R5.1
N$20
  Top 0.305: R6.1 13.73,2.05 14.48,2.79 14.48,5.08 15.11,5.71 19.27,5.71 BILED.A2
N$22
  Top 0.305: R7.2 16.24,2.05 17.53,0.76 20.32,0.76 20.7,1.14 BILED.C3
N$24
  Top 0.305: R9.2 2.7,34.45
  Top 0.406: CHARGER.5 2.76,34.89 R9.2
N$25
  Top 0.406: R17.1 20.32,47.24 21.08,48.01 24.72,48.01 M1.3
N$28
  Top 0.406: V18.4 71.59,13.21 72.39,13.21 72.81,12.79 C24.1
NRF24L01-CE  (via drill 0.5 pad 0.81)
  Top 0.305: AT328.9 20.83,28.19 20.32,28.7 v20.19,28.7
  Bottom 0.305: v20.19,28.7 24.13,28.7 24.38,28.45 49.53,28.45 50.55,29.46 60.96,29.46 61.98,30.48 65.02,30.48 66.04,31.5 66.04,36.83 65.06,37.81 U$7.3
NRF24L01-CSN  (via drill 0.5 pad 0.81)
  Top 0.305: AT328.10 22.25,28.96 21.46,28.96 20.32,30.1 v20.32,30.35
  Bottom 0.305: v20.32,30.35 20.45,30.23 24.13,30.23 25.15,29.21 49.15,29.21 50.16,30.23 54.1,30.23 61.57,37.7 U$7.4
RAW  (via drill 0.7, 0.7 pad 0.81)
  Top 0.813: ISP.2 57.78,36.24 57.78,37.97 56.26,39.5 53.98,39.5 53.34,40.13 53.34,43.24 POWER_SWITCH.P2 53.24,43.59 54.86,45.21 54.86,45.77 POWER_SWITCH.P1-TA | v30.1,32.13 25.53,36.7 25.53,38.35 v25.4,38.48 | v7.62,48.77 4.32,48.77 0.89,45.34 0.89,16.26 1.6,15.54 1.66,15.54 D1.C
  Bottom 0.813: 56,34.41 ISP.2 56,33.39 53.85,31.24 49.78,31.24 48.77,30.23 32,30.23 v30.1,32.13 | v25.4,38.48 25.4,44.7 22.86,47.24 9.14,47.24 v7.62,48.77
RAW-CHARGER  (via drill 0.5, 0.7)
  Top 0.305: v1.52,3.68 3.94,6.1 5.46,6.1 7.62,3.94 12.99,3.94 R6.2
  Top 0.406: 3.81,41.4 3.56,41.4 3.56,41.15
  Top 0.813: CHARGER.4 3.21,38.74 C13.2 3.15,40.54 3.15,40.74 3.56,41.15 | 3.81,41.4 4.57,42.16 5.84,42.16 v5.97,42.29 7.87,44.2 7.87,46.74 v9.91,48.77
  Bottom 0.406: v1.52,3.68 0.76,4.45 0.76,29.97 4.83,34.04 4.83,41.91 5.21,42.29 v5.97,42.29
  Bottom 0.813: v9.91,48.77 10.16,49.02 28.96,49.02 30.73,47.24 30.73,37.08 34.16,33.66 45.59,33.66 46.74,34.8 46.74,39.34 POWER_SWITCH.P2-TB
RCAP
  Top 0.305: VS1053.44 71.75,18.93 73.91,16.76 79.5,16.76 81.64,14.61 85.04,14.61 85.98,15.57 85.98,22.73 85.6,23.11 C8.1
RESET  (via drill 0.5 pad 0.81)
  Top 0.305: AT328.29 v16,30.61
  Top 0.406: C25.2 26.57,17.46 R8.1 26.67,18.54 25.4,19.81 v25.4,19.94
  Bottom 0.305: v25.4,19.94 16.26,29.08 16.26,30.35 v16,30.61 16,32.89 17.14,34.04 30.1,34.04 32.89,31.24 46.61,31.24 49.15,33.78 49.15,35.18 50.92,36.95 ISP.5
RIGHT
  Top 0.305: VS1053.39 69.24,19.86 69.29,19.81 69.34,19.81
  Top 0.406: R4.2 86.11,36.83 87.78,38.5 U7.RING | 69.34,19.81 69.34,19.05 73.15,15.24 78.74,15.24 83.19,10.79 AUDIO-OUT.3
  Bottom 0.406: U7.RING 87.6,38.1 84.58,38.1 80.26,33.78 80.26,13.72 83.19,10.79 AUDIO-OUT.3
RX-I  (via drill 0.5 pad 0.81)
  Top 0.305: AT328.30 13.75,29.84 14.73,29.84 v15.24,29.34
  Bottom 0.305: PROG.3 30.1,11.02 30.1,13.34 15.24,28.19 v15.24,29.34
SCK  (via drill 0.5, 0.5 pad 0.81)
  Top 0.305: AT328.17 23.48,35.29 31.34,27.43 v43.31,27.43 46.99,27.43 | USD.P$5 46.9,18.89 46.23,19.56 v45.59,19.56 | ISP.3 52.2,35.99 52.2,32.69 46.99,27.48 46.99,27.43 | 46.99,27.43 v55.88,27.43
  Bottom 0.305: v45.59,19.56 43.56,19.56 42.55,20.57 42.55,25.4 43.31,26.16 v43.31,27.43 | v55.88,27.43 59.94,27.43 61.72,29.21 SJ3.1 | U$7.5 64.23,40.35 66.29,42.42 66.29,44.96 64.52,46.74 60.96,46.74 60.45,46.23 60.45,45.21 59.18,43.94 59.18,41.4 56.39,38.61 54.81,38.61 ISP.3
SCKMP3  (via drill 0.5)
  Top 0.305: 66.74,26.26 VS1053.28 67.4,26.25 67.89,26.75 v68.15,26.82
  Bottom 0.305: SJ3.2 MP3SCK.P$1 65.81,29.18 66.62,29.18 68.15,27.66 v68.15,26.82
SD-CS  (via drill 0.5 pad 0.81)
  Top 0.305: AT328.14 23.58,32.2 30.71,25.07 52.02,25.07 52.45,24.64 52.45,24 51.18,22.73 51.18,19.68 | USD.P$2 | USD.P$2 50.22,17.76 | USD.P$2 50.16,17.81 50.16,18.67 51.18,19.68 | v54.36,18.41 54.36,18.29 53.09,19.56 51.31,19.56 51.18,19.68
  Bottom 0.305: JP1.6 54.36,11.92 v54.36,18.41
STAT  (via drill 0.5 pad 0.81)
  Top 0.305: BILED.C4 19.3,3.3 20.57,4.57 | 20.57,4.57 20.57,5.62 BILED.A1 | 20.57,4.57 20.95,4.57 22.23,3.3 v22.23,2.67
  Top 0.406: CHARGER.1 7.81,36.39 v8.13,36.07
  Bottom 0.305: 1.91,7.49 3.3,6.1 5.46,6.1 8.89,2.67 v22.23,2.67
  Bottom 0.406: v8.13,36.07 1.78,29.72 1.78,7.62 1.91,7.49
TX-O  (via drill 0.5 pad 0.81)
  Top 0.305: AT328.31 13.66,28.96 v12.19,28.96
  Bottom 0.305: PROG.2 27.56,10.77 27.56,14.73 13.34,28.96 v12.19,28.96
VBAT
  Top 0.406: 18.03,49.15 R16.1
  Top 0.813: 5.43,38.35 CHARGER.3 8.13,41.05 8.13,41.4 10.16,43.43 C12.2 10.25,44.96 10.67,44.96 11.18,45.47 11.43,45.47 12.7,46.74 0.5A.2 14.63,49.15 18.03,49.15 29.21,49.15 30.73,47.62 30.73,35.31 33.66,32.38 46.23,32.38 48.51,34.67 48.51,44.42 POWER_SWITCH.P1-TB
VBAT-RAW  (via drill 0.5)
  Top 1.778: 0.5A.1 v12.7,40.39 v12.7,39.12 v12.7,37.85
  Bottom 0.305: U$8.LIPO+ 12.41,39.4 v12.7,39.12
VCC  (via drill 0.5, 0.5 pad 0.81, 0.7)
  Top 0.254: 83.82,26.52 83.82,24.28
  Top 0.305: C17.1 76.89,39.15 73.25,35.51 VS1053.14 73.25,28.29 v72.9,27.94 70.99,27.94 70.74,28.19 VS1053.19 | 70.33,23.22 69.44,23.22 68.75,22.52 VS1053.38 68.76,19.43 64.26,14.94 C18.1 | 71.25,22.63 70.66,23.22 70.36,23.22 70.33,23.22 | 71.25,22.63 v71.25,22.61 VS1053.43 | 71.25,22.63 71.3,22.63 72.24,21.95 72.24,20.76 VS1053.45 | VS1053.32 67.82,24.26 67.84,24.23 69.32,24.23 70.33,23.22 | v72.26,25.27 72.77,24.77 75.23,24.77 VS1053.6 75.27,24.77 79.38,24.77 81.13,26.52 83.82,26.52 | AUDIO-OUT.6 84.25,19.89 81.92,22.23 81.92,23.98 82.19,24.26 83.8,24.26 83.82,24.28 | R10.2 56.71,22.35 v55.88,22.35
  Top 0.406: 64.37,12.85 64.52,12.7 65.28,12.7 66.04,11.94 68.83,11.94 69.66,11.11 V18.1 69.6,10.57 69.6,9.65 69.72,9.53 72.01,9.53
  Top 0.61: C18.1 64.37,12.85 | V18.3 71.56,9.97 72.01,9.53 72.39,9.14 74.93,9.14 v76.2,10.41
  Bottom 0.305: v72.9,27.94 72.26,27.3 v72.26,25.27 72.26,23.62 v71.25,22.61 71.25,22.63 70.81,23.06 69.46,23.06 68.75,22.35 68.75,22.37 66.7,20.32 57.91,20.32 v55.88,22.35
  Bottom 0.61: v76.2,10.41 MP3ON.1
VREG-IN  (via drill 0.5, 0.7 pad 0.81)
  Top 0.406: 60.75,6.31 ON_SWITCH.B 60.75,6.82 59.69,7.87 54.86,7.87 54.61,7.62 35.81,7.62 v35.05,8.38
  Top 0.813: v10.41,32.26 7.62,29.46 C14.A 5.46,26.24 V33.5
  Bottom 0.406: v35.05,8.38 24.64,8.38 13.97,19.05 13.97,26.16 12.45,27.69 11.43,27.69 10.92,28.19 10.92,31.75 v10.41,32.26
  Bottom 0.813: v10.41,32.26 11.68,33.53 14.73,33.53 16.51,35.31 30.73,35.31 33.66,32.38 46.23,32.38 48.13,34.29 48.13,38.61 49.28,39.75 56.01,39.75 57.91,41.66 57.91,48.77 57.4,49.28 54.36,49.28 53.34,48.26 53.34,46.75 POWER_SWITCH.P1
XTAL1_MP3
  Top 0.305: VS1053.18 71.25,37.09 71.27,37.11 71.27,40.73 | 71.98,40.84 71.98,40.85 R2.2
  Top 0.406: R2.2 71.27,40.73 C5.2 70.1,45.21 Q3.2
XTAL2_MP3
  Top 0.305: C6.2 74.7,40.85 | VS1053.17 71.75,36.52 72.39,37.16 R2.1
  Top 0.406: Q3.1 80.52,45.97 76.96,45.97 74.68,43.69 C6.2 74.08,40.13 73.66,40.13 72.56,39.03 R2.1

### Text on the board
tNames: power select | Batt | Raw | RST | SCK | MISO | RAW | MOSI | B | on | off | A | R=charging | G=full | USD card | 2led | on | off | DTR | RX-I | TX-O | 3.3V | GND | GND | power
bNames: USD card | 5V | + | - | Pierre Hoezelle V0.3
tValues: GND | 3.3V | left | gbuf | right | device | GND